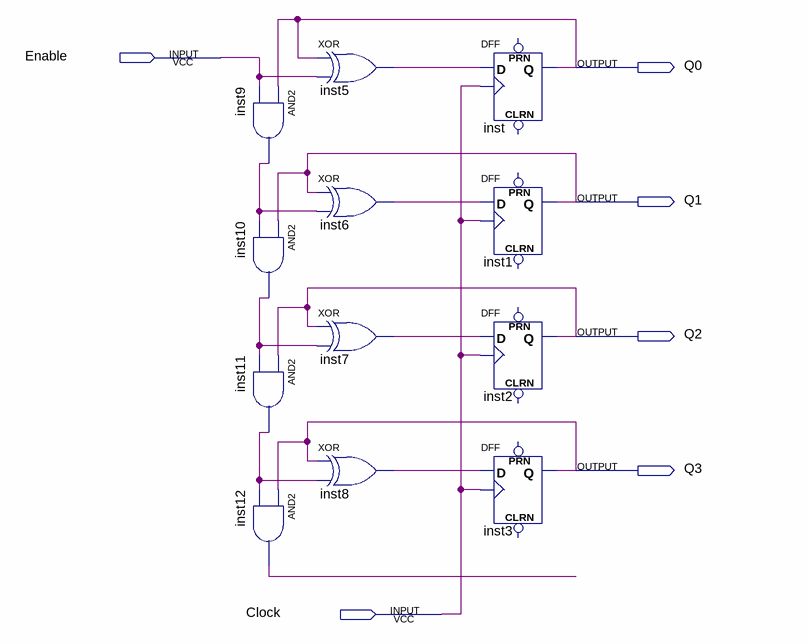
[diagram p0: schematic sheet]
// Quartus schematic Block2.bdf as structural Verilog: 12 symbols, 6 pins
module Block2 (
  input  Enable,
  input  Clock,
  output Q0,
  output Q1,
  output Q2,
  output Q3
);

  wire inst5_out, inst6_out, inst7_out, inst8_out, inst9_out, inst10_out, inst11_out, inst12_out;

  and inst9 (inst9_out, Q0, Enable);
  and inst10 (inst10_out, Q1, inst9_out);
  and inst11 (inst11_out, Q2, inst10_out);
  and inst12 (inst12_out, Q3, inst11_out);
  xor inst5 (inst5_out, Q0, Enable);
  xor inst6 (inst6_out, Q1, inst9_out);
  xor inst7 (inst7_out, Q2, inst10_out);
  xor inst8 (inst8_out, Q3, inst11_out);
  DFF inst (.CLK(Clock), .D(inst5_out), .Q(Q0));  // open: CLRN, PRN
  DFF inst1 (.CLK(Clock), .D(inst6_out), .Q(Q1));  // open: CLRN, PRN
  DFF inst2 (.CLK(Clock), .D(inst7_out), .Q(Q2));  // open: CLRN, PRN
  DFF inst3 (.CLK(Clock), .D(inst8_out), .Q(Q3));  // open: CLRN, PRN
endmodule
